# EasyEDA schematic SCH_Joki_Fariz_2026-02-15.json
TITLE: Fariz; REV: 1.0; Date: 2025-12-20; Sheet: 1/1; Drawn By: siudin22; Company: Your Company
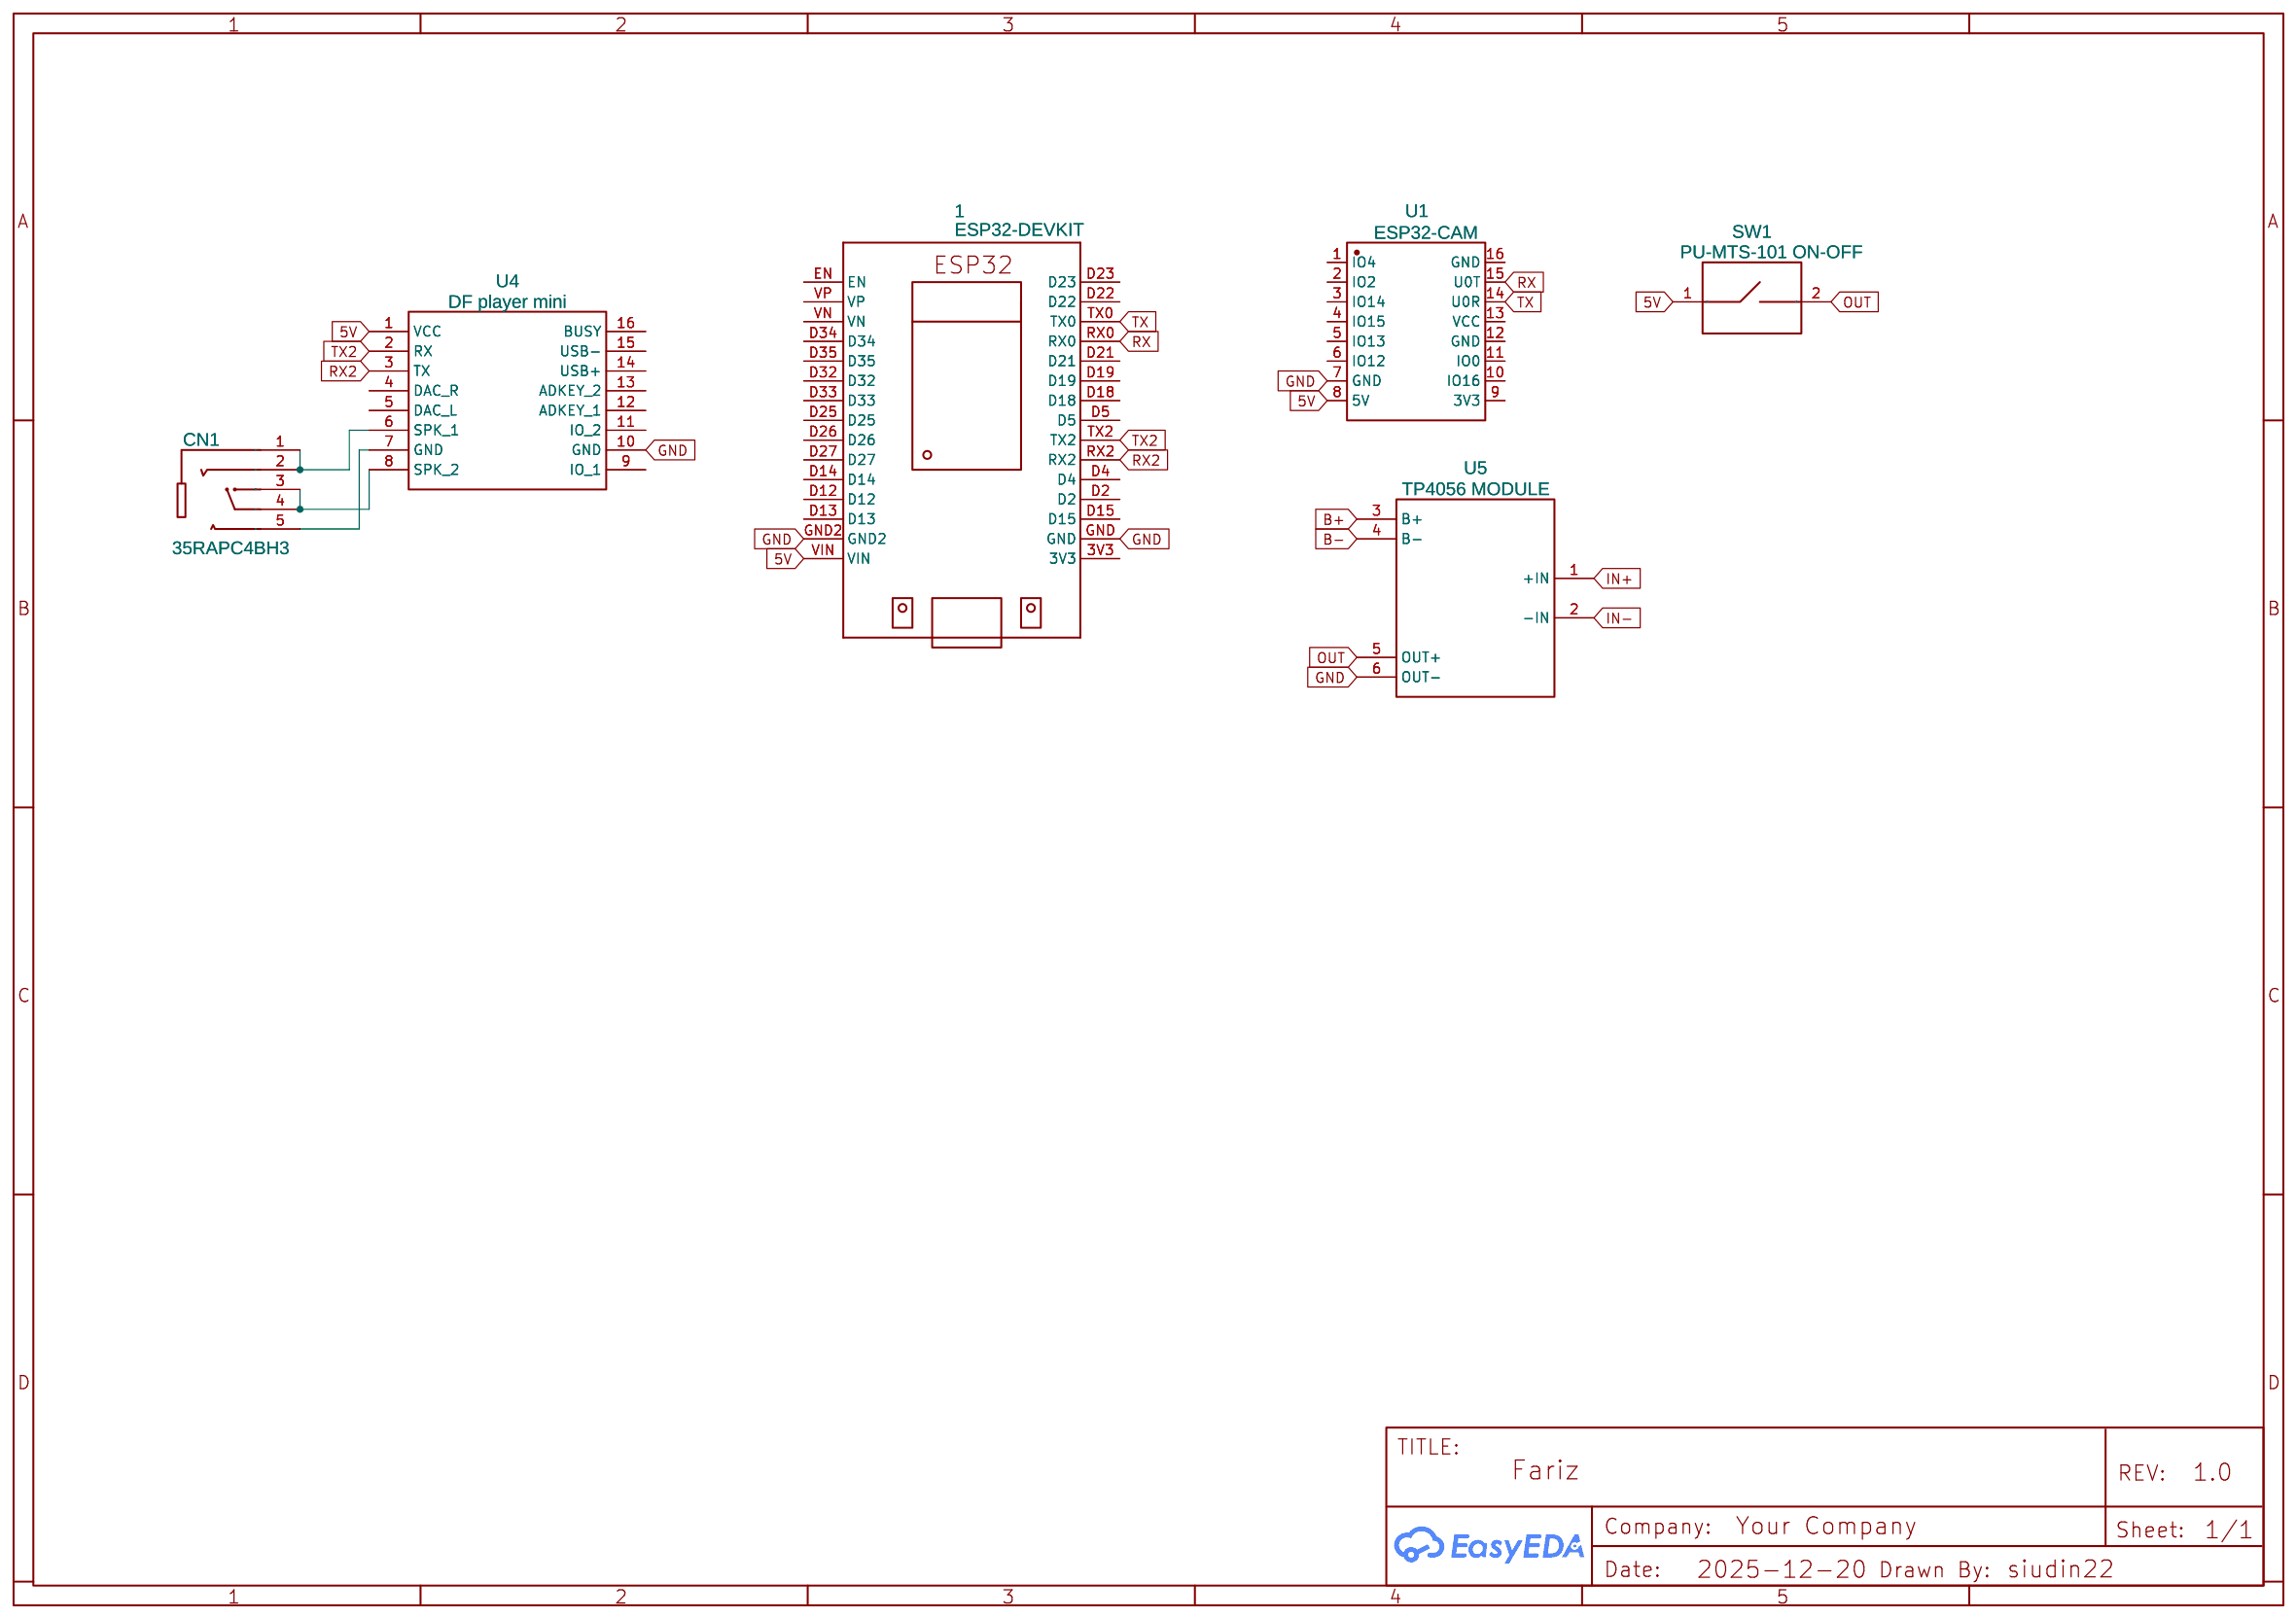
[diagram p0: schematic sheet]

## Parts
1  ESP32-DEVKIT  [ESP32-DEVKITV1_ESP32-DEVKITV1]
CN1  35RAPC4BH3  [AUDIO-TH_35RAPC4BH3]
SW1  PU-MTS-101 ON-OFF  [SW-TH_MTS-101]
U1  ESP32-CAM  [COMM-TH_16P-L40.0-W27.0-P2.54_ESP32-CAM]
U4  DF player mini  [DFPLAYER MINI MP3 PLAYER MODULE]
U5  TP4056 MODULE  [TP4056MODULE]

## Library data of the parts
1 = ESP32-DEVKIT-V1-30PIN: Contributor: ppippospinello
CN1 = 35RAPC4BH3: Supplier: LCSC; Supplier Part: C4991662; Manufacturer: Switchcraft; JLCPCB Part Class: Extended Part; Contributor: lcsc
SW1 = PU-MTS-101 ON-OFF: Supplier: LCSC; Supplier Part: C9900183724; Manufacturer: null; Manufacturer Part: pu-mts-101 ON-OFF; Contributor: lcsc; JLCPCB Part Class: Extended Part
U1 = ESP32-CAM: Supplier: LCSC; Supplier Part: C277946; Manufacturer: Ai-Thinker(安信可); JLCPCB Part Class: Extended Part; Contributor: lcsc
U4 = DF player mini: Contributor: Circuit Master; sourceId: cKDVP7pjB
U5 = TP4056 MODULE: Contributor: lovexuka367

## Nets
5V: 1.VIN SW1.1 U1.8(5V) U4.1(VCC)
GND: 1.GND 1.GND2 U1.7(GND) U4.10(GND) U5.6(OUT-)
B+: U5.3(B+)
B-: U5.4(B-)
IN+: U5.1(+IN)
IN-: U5.2(-IN)
OUT: SW1.2 U5.5(OUT+)
RX: 1.RX0 U1.15(U0T)
RX2: 1.RX2 U4.3(TX)
TX: 1.TX0 U1.14(U0R)
TX2: 1.TX2 U4.2(RX)
Net-(CN1-1): CN1.1 CN1.2 U4.6(SPK_1)
Net-(CN1-3): CN1.3 CN1.4 U4.8(SPK_2)
Net-(CN1-5): CN1.5 U4.7(GND)

Not connected (* = marked no-connect by the designer): 1 3V3 D2 D4 D5 D12 D13 D14 D15 D18 D19 D21 D22 D23 D25 D26 D27 D32 D33 D34 D35 EN VN VP; U1 1(IO4) 2(IO2) 3(IO14) 4(IO15) 5(IO13) 6(IO12) 9(3V3) 10(IO16) 11(IO0) 12(GND) 13(VCC) 16(GND); U4 4(DAC_R) 5(DAC_L) 9(IO_1) 11(IO_2) 12(ADKEY_1) 13(ADKEY_2) 14(USB+) 15(USB-) 16(BUSY)
